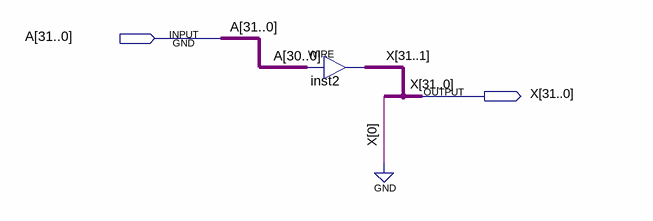
[diagram p0: schematic sheet]
// Quartus schematic shft1l32.bdf as structural Verilog: 1 symbols, 2 pins
module shft1l32 (
  input  [31:0] A,
  output [31:0] X
);

  assign X[31:1] = A[30:0];  // WIRE inst2

  assign X[0] = 1'b0;
endmodule
